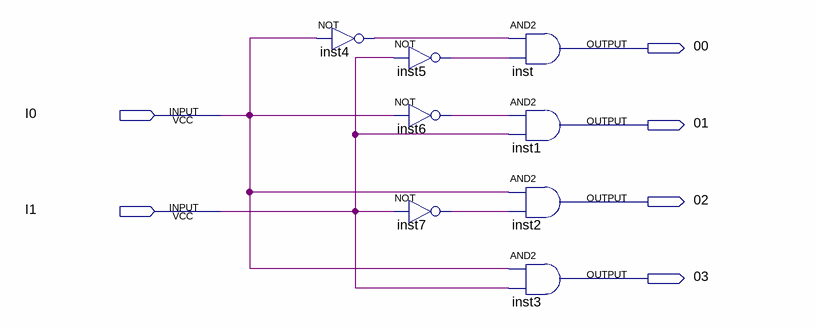
[diagram p0: schematic sheet]
// Quartus schematic DECODER_2x4.bdf as structural Verilog: 8 symbols, 6 pins
module DECODER_2x4 (
  input  I0,
  input  I1,
  output \00 ,
  output \01 ,
  output \02 ,
  output \03 
);

  wire inst4_out, inst5_out, inst6_out, inst7_out;

  not inst4 (inst4_out, I0);
  not inst5 (inst5_out, I1);
  not inst6 (inst6_out, I0);
  not inst7 (inst7_out, I1);
  and inst (\00 , inst4_out, inst5_out);
  and inst1 (\01 , inst6_out, I1);
  and inst2 (\02 , I0, inst7_out);
  and inst3 (\03 , I0, I1);
endmodule
